# Altium schematic sheet main.SchDoc
size A4
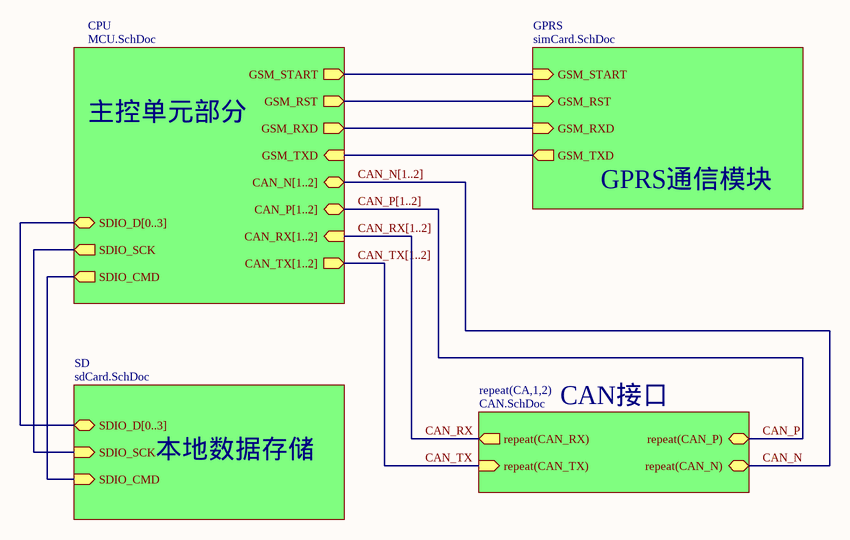
[diagram p0: main.SchDoc]

## Sub-sheets
CPU = MCU.SchDoc: CAN_TX[1..2] (out), CAN_RX[1..2] (in), SDIO_D[0..3] (bidir), SDIO_SCK (out), SDIO_CMD (out), CAN_N[1..2] (bidir), CAN_P[1..2] (bidir), GSM_START (out), GSM_RST (out), GSM_TXD (in), GSM_RXD (out)
GPRS = simCard.SchDoc: GSM_START (in), GSM_RST (in), GSM_RXD (in), GSM_TXD (out)
repeat(CA,1,2) = CAN.SchDoc: repeat(CAN_RX) (out), repeat(CAN_TX) (in), repeat(CAN_P) (bidir), repeat(CAN_N) (bidir)
SD = sdCard.SchDoc: SDIO_D[0..3] (bidir), SDIO_SCK (in), SDIO_CMD (in)

## Nets
CAN_N: sheet repeat(CA,1,2)/repeat(CAN_N)
CAN_P: sheet repeat(CA,1,2)/repeat(CAN_P)
CAN_RX: sheet repeat(CA,1,2)/repeat(CAN_RX)
CAN_TX: sheet repeat(CA,1,2)/repeat(CAN_TX)
(unnamed): sheet CPU/SDIO_SCK, sheet SD/SDIO_SCK
(unnamed): sheet CPU/SDIO_CMD, sheet SD/SDIO_CMD
(unnamed): sheet CPU/GSM_START, sheet GPRS/GSM_START
(unnamed): sheet CPU/GSM_RST, sheet GPRS/GSM_RST
(unnamed): sheet CPU/GSM_TXD, sheet GPRS/GSM_TXD
(unnamed): sheet CPU/GSM_RXD, sheet GPRS/GSM_RXD

## Buses and harness runs
bus CAN_N[1..2] = sheet CPU/CAN_N[1..2]
bus CAN_P[1..2] = sheet CPU/CAN_P[1..2]
bus CAN_RX[1..2] = sheet CPU/CAN_RX[1..2]
bus CAN_TX[1..2] = sheet CPU/CAN_TX[1..2]
bus sheet CPU/SDIO_D[0..3] = sheet SD/SDIO_D[0..3]

## Notes on the sheet
- 主控单元部分
- GPRS通信模块
- 本地数据存储
- CAN接口